# Altium schematic sheet NANO33BLE.SchDoc: NANO 33 BLE REV2
size A3; Date: 4/3/2020 11:51:50 AM; Author: Arturo Guadalupi; DocumentNumber: ABX00071/72; Revision: V6.3; SheetNumber: 1; SheetTotal: 1; Origin: Eagle; LibraryName: Arduino-utility; RevAuthor: Silvio Navaretti
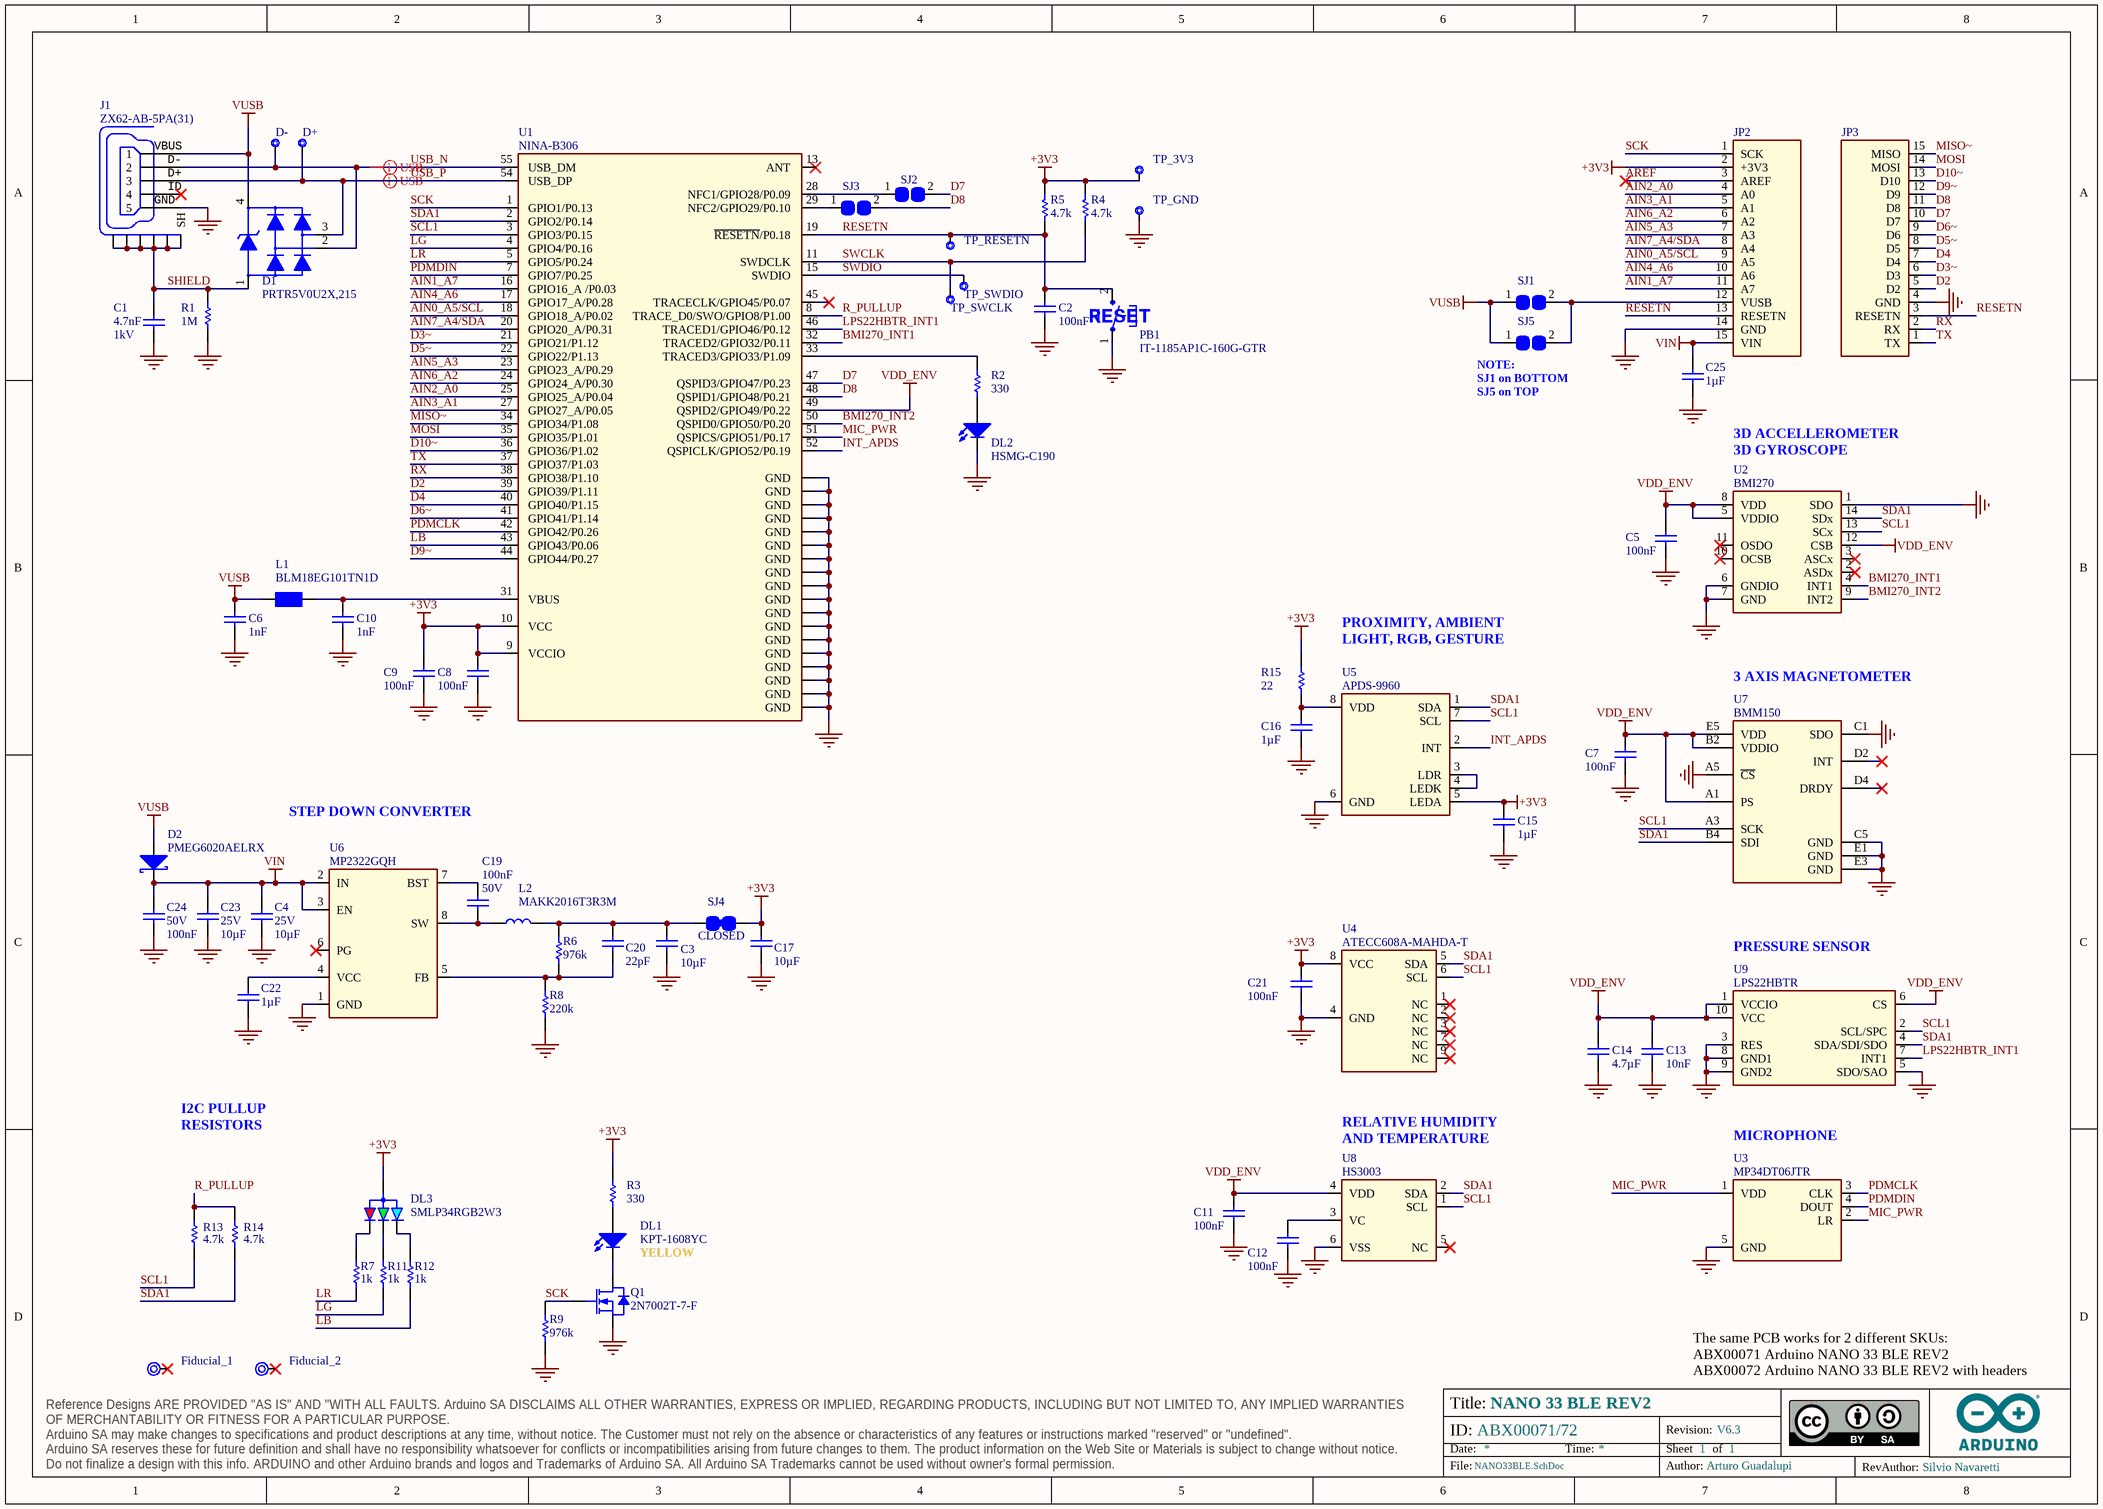
[diagram p0: NANO33BLE.SchDoc]

## Parts
C1  value 4.7nF  Voltage: 1kV  [CAP-0805]  (hidden comment: FV21X472K102ECG)
C2  value 100nF  [CAP-0402]  (hidden comment: GRM155R61H104KE19D)
C3  value 10µF  [CAP-0603]  (hidden comment: C1608A106M250NT)
C4  value 10µF  Voltage: 25V  [CAP-0603]  (hidden comment: C1608A106M250NT)
C5  value 100nF  [CAP-0402]  (hidden comment: 0402B104K160CT)
C6  value 1nF  [CAP-0402]  (hidden comment: GRM155R71H102KA01D)
C7  value 100nF  [CAP-0402]  (hidden comment: GRM155R61H104KE19D)
C8  value 100nF  [CAP-0402]  (hidden comment: GRM155R61H104KE19D)
C9  value 100nF  [CAP-0402]  (hidden comment: GRM155R61H104KE19D)
C10  value 1nF  [CAP-0402]  (hidden comment: GRM155R71H102KA01D)
C11  value 100nF  [CAP-0402]  (hidden comment: GRM155R61H104KE19D)
C12  value 100nF  [CAP-0402]  (hidden comment: GRM155R61H104KE19D)
C13  value 10nF  [CAP-0402]  (hidden comment: C1005B103K500NT)
C14  value 4.7µF  [CAP-0402]  (hidden comment: C1005A475M6R3NT)
C15  value 1µF  [CAP-0402]  (hidden comment: CL05A105KP5NNNC)
C16  value 1µF  [CAP-0402]  (hidden comment: CL05A105KP5NNNC)
C17  value 10µF  [CAP-0603]  (hidden comment: C1608A106M250NT)
C19  value 100nF  Voltage: 50V  [CAP-0402]  (hidden comment: GRM155R61H104KE19D)
C20  value 22pF  [CAP-0402]  (hidden comment: 0402N220J500CT)
C21  value 100nF  [CAP-0402]  (hidden comment: GRM155R61H104KE19D)
C22  value 1µF  [CAP-0402]  (hidden comment: CL05A105KP5NNNC)
C23  value 10µF  Voltage: 25V  [CAP-0603]  (hidden comment: C1608A106M250NT)
C24  value 100nF  Voltage: 50V  [CAP-0402]  (hidden comment: GRM155R61H104KE19D)
C25  value 1µF  [CAP-0402]  (hidden comment: CL05A105KP5NNNC)
D1  PRTR5V0U2X,215  [SOT190P230X110-4N]
D2  PMEG6020AELRX  [SOD123-1]
D+  CMP-018-0005-A.3  [TP-1.00MM]  (value not drawn)  (no BOM)
D-  CMP-018-0005-A.3  [TP-1.00MM]  (value not drawn)  (no BOM)
DL1  KPT-1608YC  [LEDC1608X80N-AK]
DL2  HSMG-C190  [LEDC1608X80N-AK]
DL3  SMLP34RGB2W3  [SMLP34RGB2W]
Fiducial_1  Fiducial mark 1mm with 2mm solder  [Fiducial mark 1mm with circle-Footprint-1]  (value not drawn)  (no BOM)
Fiducial_2  Fiducial mark 1mm with 2mm solder  [Fiducial mark 1mm with circle-Footprint-1]  (value not drawn)  (no BOM)
J1  ZX62-AB-5PA(31)  [ZX62-AB-5PA]
JP2  PINHD-1X15-NANO-ANALOG-CASTELLATED  [PINHD-1X14_5VF]  (value not drawn)
JP3  PINHD-1X15-NANO-DIGITAL-CASTELLATED  [PINHD-1X14_5VF]  (value not drawn)
L1  BLM18EG101TN1D  [L-0603]
L2  MAKK2016T3R3M  [MAKK2016T3R3M-Footprint-1]
PB1  IT-1185AP1C-160G-GTR  [C&K_PTS820_NO_HOLES-1]
Q1  2N7002T-7-F  [SOT523]
R1  value 1M  [RES-0402]  (hidden comment: CRCW04021M00FKED)
R2  value 330  [RES-0402]  (hidden comment: CRCW0402330RJNED)
R3  value 330  [RES-0402]  (hidden comment: CRCW0402330RJNED)
R4  value 4.7k  [RES-0402]  (hidden comment: RC0402FR-074K7L)
R5  value 4.7k  [RES-0402]  (hidden comment: RC0402FR-074K7L)
R6  value 976k  [RES-0402]  (hidden comment: CRCW0402976KFKED)
R7  value 1k  [RES-0402]  (hidden comment: CRCW04021K00FKEDC)
R8  value 220k  [RES-0402]  (hidden comment: CRCW0402220KFKED)
R9  value 976k  [RES-0402]  (hidden comment: CRCW0402976KFKED)
R11  value 1k  [RES-0402]  (hidden comment: CRCW04021K00FKEDC)
R12  value 1k  [RES-0402]  (hidden comment: CRCW04021K00FKEDC)
R13  value 4.7k  [RES-0402]  (hidden comment: RC0402FR-074K7L)
R14  value 4.7k  [RES-0402]  (hidden comment: RC0402FR-074K7L)
R15  value 22  [RES-0402]  (hidden comment: RC0402FR-0722RL)
SJ1  SMD solder JUMPER 0805  [SJ]  (value not drawn)
SJ2  SMD solder JUMPER 0805  [SJ]  (value not drawn)
SJ3  SMD solder JUMPER 0805  [SJ]  (value not drawn)
SJ4  SMD solder JUMPER CLOSED  [SJ]  (value not drawn)
SJ5  SMD solder JUMPER 0805  [SJ]  (value not drawn)
TP_3V3  CMP-018-0005-A.3  [TP-1.00MM]  (value not drawn)  (no BOM)
TP_GND  CMP-018-0005-A.3  [TP-1.00MM]  (value not drawn)  (no BOM)
TP_RESETN  CMP-018-0005-A.3  [TP-1.00MM]  (value not drawn)  (no BOM)
TP_SWCLK  CMP-018-0005-A.3  [TP-1.00MM]  (value not drawn)  (no BOM)
TP_SWDIO  CMP-018-0005-A.3  [TP-1.00MM]  (value not drawn)  (no BOM)
U1  NINA-B306  [NINA-B3X]
U2  BMI270  [VFLGA14]
U3  MP34DT06JTR  [HCLGA]
U4  ATECC608A-MAHDA-T  [UDFN8]
U5  APDS-9960  [APDS-9660-Footprint-1]
U6  MP2322GQH  [QFN50P150X200X90-8L]
U7  BMM150  [FP-BMM150-MFG]
U8  HS3003  [HS3003-Footprint-1]
U9  LPS22HBTR  [LPS22H]

## Nets
+3V3: C8.2 C9.1 C15.2 C17.2 C21.2 DL3.1(ANODE) JP2.2(+3V3) R3.2 R4.2 R5.2 R15.2 SJ4.2 TP_3V3.X U1.9(VCCIO) U1.10(VCC) U4.8(VCC) U5.5(LEDA)
GND: C1.1 C2.2 C3.1 C4.1 C5.2 C6.2 C7.1 C8.1 C9.2 C10.2 C11.2 C12.2 C13.2 C14.2 C15.1 C16.1 C17.1 C21.1 C22.1 C23.1 C24.2 C25.1 DL2.C J1.5 JP2.14(GND) JP3.4(GND) PB1.1 Q1.S R1.1 R8.1 R9.1 TP_GND.X U1.6(GND) U1.12(GND) U1.14(GND) U1.26(GND) U1.30(GND) U1.53(GND) U1.GND1(GND) U1.GND2(GND) U1.GND3(GND) U1.GND4(GND) U1.GND5(GND) U1.GND6(GND) U1.GND7(GND) U1.GND8(GND) U1.GND9(GND) U1.GND10(GND) U1.GND11(GND) U1.GND12(GND) U2.1(SDO) U2.6(GNDIO) U2.7(GND) U3.5(GND) U4.4(GND) U5.6(GND) U6.1(GND) U7.A5(~{CS}) U7.C1(SDO) U7.C5(GND) U7.E1(GND) U7.E3(GND) U8.6(VSS) U9.3(RES) U9.5(SDO/SAO) U9.8(GND1) U9.9(GND2)
VDD_ENV: C5.1 C7.2 C11.1 C13.1 C14.1 U1.49(QSPID2/GPIO49/P0.22) U2.5(VDDIO) U2.8(VDD) U2.12(CSB) U7.A1(PS) U7.B2(VDDIO) U7.E5(VDD) U8.4(VDD) U9.1(VCCIO) U9.6(CS) U9.10(VCC)
VIN: C4.2 C23.2 C24.1 C25.2 D2.C JP2.15(VIN) U6.2(IN) U6.3(EN)
VUSB: C6.1 D1.4 D2.A J1.1 L1.1 SJ1.1 SJ5.1
AIN0_A5/SCL: JP2.9(A5) U1.18(GPIO18_A/P0.02)
AIN1_A7: JP2.11(A7) U1.16(GPIO16_A_/P0.03)
AIN2_A0: JP2.4(A0) U1.25(GPIO25_A/P0.04)
AIN3_A1: JP2.5(A1) U1.27(GPIO27_A/P0.05)
AIN4_A6: JP2.10(A6) U1.17(GPIO17_A/P0.28)
AIN5_A3: JP2.7(A3) U1.23(GPIO23_A/P0.29)
AIN6_A2: JP2.6(A2) U1.24(GPIO24_A/P0.30)
AIN7_A4/SDA: JP2.8(A4) U1.20(GPIO20_A/P0.31)
AREF: JP2.3(AREF)
BMI270_INT1: U1.32(TRACED2/GPIO32/P0.11) U2.4(INT1)
BMI270_INT2: U1.50(QSPID0/GPIO50/P0.20) U2.9(INT2)
D2: JP3.5(D2) U1.39(GPIO39/P1.11)
D3~: JP3.6(D3) U1.21(GPIO21/P1.12)
D4: JP3.7(D4) U1.40(GPIO40/P1.15)
D5~: JP3.8(D5) U1.22(GPIO22/P1.13)
D6~: JP3.9(D6) U1.41(GPIO41/P1.14)
D7: JP3.10(D7) SJ2.2 U1.47(QSPID3/GPIO47/P0.23)
D8: JP3.11(D8) SJ3.2 U1.48(QSPID1/GPIO48/P0.21)
D9~: JP3.12(D9) U1.44(GPIO44/P0.27)
D10~: JP3.13(D10) U1.36(GPIO36/P1.02)
INT_APDS: U1.52(QSPICLK/GPIO52/P0.19) U5.2(INT)
LB: R12.1 U1.43(GPIO43/P0.06)
LG: R11.1 U1.4(GPIO4/P0.16)
LPS22HBTR_INT1: U1.46(TRACED1/GPIO46/P0.12) U9.7(INT1)
LR: R7.1 U1.5(GPIO5/P0.24)
MIC_PWR: U1.51(QSPICS/GPIO51/P0.17) U3.1(VDD) U3.2(LR)
MISO~: JP3.15(MISO) U1.34(GPIO34/P1.08)
MOSI: JP3.14(MOSI) U1.35(GPIO35/P1.01)
PDMCLK: U1.42(GPIO42/P0.26) U3.3(CLK)
PDMDIN: U1.7(GPIO7/P0.25) U3.4(DOUT)
R_PULLUP: R13.2 R14.2 U1.8(TRACE_D0/SWO/GPIO8/P1.00)
RESETN: C2.1 JP2.13(RESETN) JP3.3(RESETN) PB1.2 R5.1 TP_RESETN.X U1.19(~{RESETN}/P0.18)
RX: JP3.2(RX) U1.38(GPIO38/P1.10)
SCK: JP2.1(SCK) Q1.G R9.2 U1.1(GPIO1/P0.13)
SCL1: R13.1 U1.3(GPIO3/P0.15) U2.13(SCx) U4.6(SCL) U5.7(SCL) U7.A3(SCK) U8.1(SCL) U9.2(SCL/SPC)
SDA1: R14.1 U1.2(GPIO2/P0.14) U2.14(SDx) U4.5(SDA) U5.1(SDA) U7.B4(SDI) U8.2(SDA) U9.4(SDA/SDI/SDO)
SHIELD: C1.2 D1.1 J1.M1(SH) J1.M2(SH) J1.M3(SH) J1.M4(SH) J1.M5(SH) J1.M6(SH) R1.2
SWCLK: R4.1 TP_SWCLK.X U1.11(SWDCLK)
SWDIO: TP_SWDIO.X U1.15(SWDIO)
TX: JP3.1(TX) U1.37(GPIO37/P1.03)
USB_N: D1.2 D-.X J1.2 U1.55(USB_DM)
USB_P: D1.3 D+.X J1.3 U1.54(USB_DP)
NetC3_2: C3.2 C20.2 L2.2 R6.2 SJ4.1
NetC10_1: C10.1 L1.2 U1.31(VBUS)
NetC12_1: C12.1 U8.3(VC)
NetC16_2: C16.2 R15.1 U5.8(VDD)
NetC19_1: C19.1 L2.1 U6.8(SW)
NetC19_2: C19.2 U6.7(BST)
NetC20_1: C20.1 R6.1 R8.2 U6.5(FB)
NetC22_2: C22.2 U6.4(VCC)
NetDL1_A: DL1.A R3.1
NetDL1_C: DL1.C Q1.D
NetDL2_A: DL2.A R2.1
NetDL3_2: DL3.2(RED_C) R7.2
NetDL3_3: DL3.3(BLUE_C) R12.2
NetDL3_4: DL3.4(GREEN_C) R11.2
NetJP2_12: JP2.12(VUSB) SJ1.2 SJ5.2
NetR2_2: R2.2 U1.33(TRACED3/GPIO33/P1.09)
NetSJ2_1: SJ2.1 U1.28(NFC1/GPIO28/P0.09)
NetSJ3_1: SJ3.1 U1.29(NFC2/GPIO29/P0.10)
NetU5_3: U5.3(LDR) U5.4(LEDK)

Not connected (* = marked no-connect by the designer): Fiducial_1 1*; Fiducial_2 1*; J1 4*; U1 13(ANT)* 45(TRACECLK/GPIO45/P0.07)*; U2 2(ASDx)* 3(ASCx)* 10(OCSB)* 11(OSDO)*; U4 1(NC)* 2(NC)* 3(NC)* 7(NC)* 9(NC)*; U6 6(PG)*; U7 D2(INT)* D4(DRDY)*; U8 5(NC)*

## Layout directives
differential pair; differential pair class USB: USB_N, USB_P

## Notes on the sheet
- (near PB1) RESET
- (near SJ5) NOTE:
  SJ1 on BOTTOM
  SJ5 on TOP
- 3D ACCELLEROMETER
  3D GYROSCOPE
- PROXIMITY, AMBIENT LIGHT, RGB, GESTURE
- (near U7) 3 AXIS MAGNETOMETER
- STEP DOWN CONVERTER
- AUTHENTICATOR
- (near U9) PRESSURE SENSOR
- RGB LED
- SCK LED
- I2C PULLUP RESISTORS
- RELATIVE HUMIDITY
  AND TEMPERATURE
- MICROPHONE
- YELLOW
- The same PCB works for 2 different SKUs:
  ABX00071 Arduino NANO 33 BLE REV2
  ABX00072 Arduino NANO 33 BLE REV2 with headers
- Title:
- ID:
- Date:
- Time:
- Revision:
- Sheet
- of
- RevAuthor:
- Reference Designs ARE PROVIDED "AS IS" AND "WITH ALL FAULTS. Arduino SA DISCLAIMS ALL OTHER WARRANTIES, EXPRESS OR IMPLIED, REGARDING PRODUCTS, INCLUDING BUT NOT LIMITED TO, ANY IMPLIED WARRANTIES OF MERCHANTABILITY OR FITNESS FOR A PARTICULAR PURPOSE.
  Arduino SA may make changes to specifications and product descriptions at any time, without notice. The Customer must not rely on the absence or characteristics of any features or instructions marked "reserved" or "undefined".
  Arduino SA reserves these for future definition and shall have no responsibility whatsoever for conflicts or incompatibilities arising from future changes to them. The product information on the Web Site or Materials is subject to change without notice.
  Do not finalize a design with this info. ARDUINO and other Arduino brands and logos and Trademarks of Arduino SA. All Arduino SA Trademarks cannot be used without owner's formal permission.
- File:
- Author:
- (in symbol J0039-A.7) VBUS; D-; D+; ID; GND

## Library data of the parts
C1 = C0059-A.14: CAP CHIP 0805 4.7nF 10% 1000V X7R; Manufacturer: PSA Shenzen; Code Arduino: 0689; Manufacturer 2: KEMET; Tolerance: 10%; Case Code (Imperial): 0805; Part Number: FV21X472K102ECG; Dielectric: X7R; Part number 2: C0805V472KDRACTU; Part number 3: C0805C472KDRACTU; Manufacturer 3: KEMET; Technology: Ceramic
C2 C7-C9 C11 C12 C19 C21 C24 = C0015-A.14: CAP CHIP 0402 100nF 10% 50V X5R; Manufacturer: Murata; Code Arduino: A5141; Dielectric: X5R; Part Number: GRM155R61H104KE19D; Tolerance: 10%; Case Code (Imperial): 0402; Technology: Ceramic
  C2 C7-C9 C11 C12 C21: Voltage: 50V
C3 C4 C17 C23 = C0047-A.18: CAP CHIP 0603 10uF 20% 25V X5R; Manufacturer: Hottech; Code Arduino: 2213; Manufacturer 2: Murata Electronics; Part Number: C1608A106M250NT; Dielectric: X5R; Tolerance: 20%; Case Code (Imperial): 0603; Part number 2: CL10A106MA8NRNC; Technology: Ceramic
  C3 C17: Voltage: 25V
C5 = C0012-A.15: CAP CHIP 0402 100nF 10% 16V X7R; Manufacturer: Walsin; Code Arduino: 0132; Dielectric: X7R; Part Number: 0402B104K160CT; Tolerance: 10%; Voltage: 16V; Case Code (Imperial): 0402; Technology: Ceramic
C6 C10 = C0007-A.15: CAP CHIP 0402 1nF 10% 50V X7R; Manufacturer: KEMET; Code Arduino: 2321; Case Code (Imperial): 0402; Part Number: GRM155R71H102KA01D; Tolerance: 10%; Dielectric: X7R; Voltage: 50V; Technology: Ceramic
C13 = C0009-A.15: CAP CHIP 0402 10nF 10% 50V X7R; Manufacturer: Hottech; Code Arduino: 0165; Case Code (Imperial): 0402; Voltage: 50V; Tolerance: 10%; Dielectric: X7R; Manufacturer 2: Murata Electronics; Part Number: C1005B103K500NT; Part number 2: CC0402KRX7R9BB103; Manufacturer 3: YAGEO; Technology: Ceramic
C14 = C0037-A.14: CAP CHIP 0402 4.7uF 20% 6V3 X5R; Manufacturer: Hottech; Code Arduino: 0833; Voltage: 6.3V; Case Code (Imperial): 0402; Part Number: C1005A475M6R3NT; Tolerance: 20%; Manufacturer 2: Samsung Electro-Mechanics; Dielectric: X5R; Technology: Ceramic; Manufacturer 3: Murata Electronics; Part number 3: GRM155R60J475ME47D; Part number 2: CL05A475KQ5NRNC
C15 C16 C22 C25 = C0017-A.14: CAP CHIP 0402 1uF 10% 10V X5R; Manufacturer: Samsung Electro-Mechanics; Code Arduino: 0133; Voltage: 10V; Dielectric: X5R; Case Code (Imperial): 0402; Part Number: CL05A105KP5NNNC; Manufacturer 2: Murata Electronics; Tolerance: 10%; Technology: Ceramic; Part number 2: GCM155C71A105KE38D
C20 = C0029-A.14: CAP CHIP 0402 22pF 5% 50V C0G; Manufacturer: Walsin; Code Arduino: 0137; Case Code (Imperial): 0402; Tolerance: 5%; Part Number: 0402N220J500CT; Manufacturer 2: Murata Electronics; Voltage: 50V; Dielectric: C0G; Part number 3: C0402C220K5GAC7867; Part number 2: GRM1555C1H220JA01D; Manufacturer 3: KEMET; Technology: Ceramic
D1 = D0025-A.5: TVS ARRAY 4LIN.8kV 1pF SOT143B; Manufacturer: Nexperia; Device Type: ESD protection; Code Arduino: 2209; Part Number: PRTR5V0U2X,215
D2 = D0026-A.6: DIODE SCHOTTKY SMD 2A 60V SOD123FL; Manufacturer: Nexperia; Manucturer Part Number 2: SS26L; Code Arduino: 2208; Forward Voltage: 0.6V; Manucturer 2: Hottech; RoHS Compliance: RoHS3; Part Number: PMEG6020AELRX; Device Type: Diode Schottky; Forward Current: 2A
D+ D- TP_3V3 TP_GND TP_RESETN TP_SWCLK TP_SWDIO = UT0013-A.4: Test point 1.00mm; Source: ut.SchLib; Design Item ID: CMP-018-0005-A.3; Pin Count: 1
DL1 = L0008-A.5: LED SMD 0603 GIA588   8mcd 120^; Manufacturer: Kingbright; Code Arduino: 2243; Part Number: KPT-1608YC; Pin Count: 2
DL2 = L0009-A.5: LED SMD 0603 GREEN/568 15mcd 120^; Manufacturer: Broadcom; Code Arduino: 2204; Part Number: HSMG-C190; Pin Count: 2
DL3 = L0014-A.11: LED RGB DIFFUSED PICOLED SMD; Manufacturer: ROHM Semiconductor; Code Arduino: A5469; Forward Current: 20mA; Lens Style: Rectangular; Dominant Wavelength: 470nm; Forward Voltage: 3V; Test Current: 5mA; Luminous Intensity: 45mcd; Lens Color: White; Pin Count: 4; Part Number: SMLP34RGB2W3; Lens Transparency: Diffused; Number of Pins: 4; Mount: Surface Mount; Color: Blue,Green,Red; Packaging: Tape and Reel; Height: 0.25mm; Width: 1mm; Package Quantity: 1; Case Code (Imperial): 0404; Lead Free: Lead Free; Min Operating Temperature: -40°C; Max Operating Temperature: 85°C; Length: 1mm
Fiducial_1 Fiducial_2 = UT0024-A.6
J1 = J0039-A.7: CONN USB MICRO F/90^ SMD TipoAB 5x1; Manufacturer: Hirose; Code Arduino: 2219; Part Number: ZX62-AB-5PA(31)
JP2 = J0158-A.4: CONN THD SOCKET F/1/D 15V JANALOG NANO-TYPE CASTELLATED; Code Arduino: 0646; Pin Count: 15
JP3 = J0183-A.4: CONN THD SOCKET F/1/D 15V JDIGITAL NANO-TYPE CASTELLATED; Code Arduino: 0646; Pin Count: 15
L1 = I0022-A.5: FERRITE SMD 0603 45mOHM 2A; Manufacturer: Murata; DC Resistance (DCR): 45mR; Test Frequency: 100MHz; Code Arduino: A5482; Tolerance: 25%; Part Number: BLM18EG101TN1D; Device Type: Ferrite; Min Operating Temperature: -55°C; Current: 2A; Case Code (Metric): 1608; Max DC Current: 2A; Case Code (Imperial): 0603; Package Quantity: 1; Max Operating Temperature: 125°C; Packaging: Tape and Reel
L2 = I0045-A.10: IND CHIP 0806 3.3 uH 20% 1.2A; Manufacturer: Taiyo Yuden; Max DC Current: 1.15A; Core Material: Metal; DC Resistance (DCR): 255mR; Code Arduino: I0045; Test Frequency: 2MHz; Inductance: 3.3µH; Shielding: Shielded; Value: 3.3µH; Max Operating Temperature: 105°C; Height - Seated (Max): 0.039inch; Halogen Free: Halogen Free; Device Type: Inductor; Min Operating Temperature: -40°C; Length: 0.079inch; Packaging: Tape and Reel; Termination: SMD/SMT; Mount: Surface Mount; Height: 1mm; Manufacturer 2: Murata; Saturation Current: 1.15A; Part Number: MAKK2016T3R3M; Package Quantity: 3000; Case Code (Imperial): 0806; Manufacturer Part Number 2: LQM2MPN3R3NG0L; Width: 1.6mm; Tolerance: 20%; Resistor Type: Wirewound; Case Code (Metric): 2016; Case/Package: 0806; Current Rating: 1.2A
PB1 = B0001-A.7: PUSHBUTTON WHITE NO ANCHORS; Manufacturer: Switronic; Code Arduino: 0173; Color: White; Mount: SMT; Part Number: IT-1185AP1C-160G-GTR
Q1 = T0003-A.2: MOSFET N-CH 60V 115mA SOT523; Manufacturer: Diodes Inc.; Device Type: Mosfet N-CH SMD; Code Arduino: 2368; Pin Count: 3; Part Number: 2N7002T-7-F
R1 = R0058-A.24: RES CHIP 0402 1M 1% 1/16W; Manufacturer: Vishay; Power: 62.5mW; Code Arduino: 0139; Temperature coefficient: 100ppm; Case Code (Imperial): 0402; Tolerance: 1%; Part Number: CRCW04021M00FKED; Technology: Thick film
R2 R3 = R0017-A.24: RES CHIP 0402 330R 5% 1/16W; Manufacturer: Vishay; Power: 62.5mW; Code Arduino: 2229; Temperature coefficient: 200ppm; Tolerance: 5%; Part Number: CRCW0402330RJNED; Case Code (Imperial): 0402; Technology: Thick film
R4 R5 = R0013-A.24: RES CHIP 0402 4k7 1% 1/16W; Manufacturer: YAGEO; Code Arduino: 2196; Power: 62.5mW; Temperature coefficient: 200ppm; Part Number: RC0402FR-074K7L; Tolerance: 1%; Case Code (Imperial): 0402; Technology: Thick film
R6 R9 = R0070-A.25: RES CHIP 0402 976k 1% 1/16W; Manufacturer: Vishay; Power: 62.5mW; Code Arduino: R0070; Temperature coefficient: 100ppm; Tolerance: 1%; Part Number: CRCW0402976KFKED; Case Code (Imperial): 0402; Technology: Thick film
R7 R11 R12 = R0007-A.24: RES CHIP 0402 1k 1% 1/16W; Manufacturer: Vishay; Power: 62.5mW; Code Arduino: 0140; Temperature coefficient: 100ppm; Case Code (Imperial): 0402; Tolerance: 1%; Part Number: CRCW04021K00FKEDC; Technology: Thick film
R8 = R0028-A.24: RES CHIP 0402 220k 1% 1/16W; Manufacturer: Vishay; Code Arduino: 2334; Power: 62.5mW; Temperature coefficient: 200ppm; Part Number: CRCW0402220KFKED; Case Code (Imperial): 0402; Tolerance: 1%; Technology: Thick film
R13 R14 = R0013-A.24: RES CHIP 0402 4k7 1% 1/16W; Manufacturer: YAGEO; Power: 62.5mW; Code Arduino: 2196; Temperature coefficient: 200ppm; Part Number: RC0402FR-074K7L; Tolerance: 1%; Case Code (Imperial): 0402; Technology: Thick film
R15 = R0009-A.24: RES CHIP 0402 22R 1% 1/16W; Manufacturer: YAGEO; Power: 62.5mW; Code Arduino: 0468; Temperature coefficient: 100ppm; Tolerance: 1%; Case Code (Imperial): 0402; Part Number: RC0402FR-0722RL; Technology: Thick film
SJ1-SJ3 SJ5 = UT0002-A.5: Solder Jumper 0805 THIS IS NOT A COMPONENT; Code Arduino: This is not a component
SJ4 = UT0006-A.14: Solder Jumper shorted pads. This is not a component
U1 = M0001-A.9: MODULE BLE 5.0 STAND ALONE nRF52; Manufacturer: UBlox; Code Arduino: NINA-B306; Pin Count: 67; Part Number: NINA-B306
U2 = U0217-A.4: IC IMU 6 AXIS 14VFLGA pin to pin alternative to LSM6DSOXTR; Manufacturer: Bosch Sensortec; Code Arduino: U0217; Part Number: BMI270
U3 = U0074-A.6: SENS MEMS AUDIO OMNIDIRECTIONAL; Manufacturer: ST Microelectronics; Code Arduino: A5470; Part Number: MP34DT06JTR
U4 = U0034-A.8: IC AUTHENTICATION CHIP UDFN8; Manufacturer: Microchip; Code Arduino: U0034; Part Number: ATECC608A-MAHDA-T
U5 = U0136-A.9: IC SENS OPT 560NM AMBIENT MODULE APDS-9960; Manufacturer: Broadcom; Code Arduino: A5475; Part Number: APDS-9960
U6 = U0072-A.8: IC STEP DOWN CONV 1A 22V QFN8; Manufacturer: Monolithic Power Systems; Code Arduino: U0072; Part Number: MP2322GQH
U7 = U0153-A.4: IC SENSOR 3-AXIS GEOMAGNETIC; Manufacturer: Bosch Sensortec; Code Arduino: U0153; Part Number: BMM150
U8 = U0253-A.5: IC PRESSURE AND TEMPERATURE SENSOR 6-LGA; Manufacturer: Renesas; Code Arduino: U0253; Part Number: HS3003
U9 = U0009-A.7: SENSOR PRESSURE 3.77 PSI ~ 18.27 PSI (26 kPa ~ 126 kPa) Absolute 24 b 10-WFLGA; Manufacturer: ST Microelectronics; Code Arduino: A5390; Part Number: LPS22HBTR